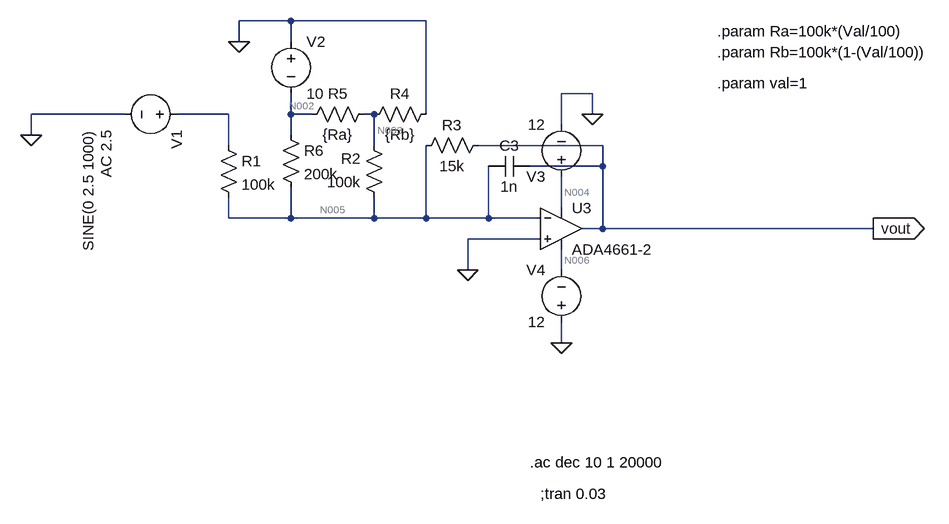
[diagram p0: schematic CV circuits.asc]
CV circuits.asc, the LTspice schematic file:
Version 4
SHEET 1 1768 680
WIRE 400 -144 320 -144
WIRE 608 -144 400 -144
WIRE 320 -112 320 -144
WIRE 400 -112 400 -144
WIRE 864 -32 816 -32
WIRE 144 0 0 0
WIRE 304 0 224 0
WIRE 400 0 400 -32
WIRE 432 0 400 0
WIRE 528 0 512 0
WIRE 608 0 608 -144
WIRE 864 0 864 -32
WIRE 816 16 816 -32
WIRE 0 32 0 0
WIRE 400 32 400 0
WIRE 304 48 304 0
WIRE 528 48 528 0
WIRE 880 48 688 48
WIRE 880 80 880 48
WIRE 880 80 768 80
WIRE 816 144 816 96
WIRE 304 160 304 128
WIRE 400 160 400 112
WIRE 400 160 304 160
WIRE 528 160 528 128
WIRE 528 160 400 160
WIRE 608 160 608 48
WIRE 608 160 528 160
WIRE 704 160 704 80
WIRE 704 160 608 160
WIRE 784 160 704 160
WIRE 880 176 880 80
WIRE 880 176 848 176
WIRE 1296 176 880 176
WIRE 784 192 672 192
WIRE 672 240 672 192
WIRE 816 240 816 208
WIRE 816 352 816 320
FLAG 1296 176 vout
IOPIN 1296 176 Out
FLAG 816 352 0
FLAG 864 0 0
FLAG 0 32 0
FLAG 672 240 0
FLAG 320 -112 0
SYMBOL voltage 240 0 R90
WINDOW 3 24 152 Left 2
WINDOW 123 24 124 Left 2
WINDOW 39 0 0 Left 0
SYMATTR Value SINE(0 2.5 1000)
SYMATTR Value2 AC 2.5
SYMATTR InstName V1
SYMBOL res 544 144 R180
WINDOW 0 36 76 Left 2
WINDOW 3 36 40 Left 2
SYMATTR InstName R2
SYMATTR Value 100k
SYMBOL res 704 32 R90
WINDOW 0 0 56 VBottom 2
WINDOW 3 32 56 VTop 2
SYMATTR InstName R3
SYMATTR Value 15k
SYMBOL voltage 816 112 R180
WINDOW 123 0 0 Left 0
WINDOW 39 0 0 Left 0
SYMATTR InstName V3
SYMATTR Value 12
SYMBOL voltage 816 336 R180
WINDOW 0 24 96 Left 2
WINDOW 3 24 16 Left 2
WINDOW 123 0 0 Left 0
WINDOW 39 0 0 Left 0
SYMATTR InstName V4
SYMATTR Value 12
SYMBOL Opamps\\ADA4661-2 816 112 R0
SYMATTR InstName U3
SYMBOL cap 768 64 R90
WINDOW 0 0 32 VBottom 2
WINDOW 3 32 32 VTop 2
SYMATTR InstName C3
SYMATTR Value 1n
SYMBOL res 288 32 R0
SYMATTR InstName R1
SYMATTR Value 100k
SYMBOL voltage 400 -128 R0
WINDOW 123 0 0 Left 0
WINDOW 39 0 0 Left 0
SYMATTR InstName V2
SYMATTR Value 10
SYMBOL res 528 -16 R90
WINDOW 0 0 56 VBottom 2
WINDOW 3 32 56 VTop 2
SYMATTR InstName R5
SYMATTR Value {Ra}
SYMBOL res 384 16 R0
SYMATTR InstName R6
SYMATTR Value 200k
SYMBOL res 624 -16 R90
WINDOW 0 0 56 VBottom 2
WINDOW 3 32 56 VTop 2
SYMATTR InstName R4
SYMATTR Value {Rb}
TEXT 768 536 Left 2 !.ac dec 10 1 20000
TEXT 784 584 Left 2 !;tran 0.03
TEXT 1056 -128 Left 2 !.param Ra=100k*(Val/100)
TEXT 1056 -96 Left 2 !.param Rb=100k*(1-(Val/100))
TEXT 1056 -48 Left 2 !.param val=1

The netlist it stands for:
* CV circuits.asc
V1 N001 0 SINE(0 2.5 1000) AC 2.5
R2 N005 N003 100k
R3 vout N005 15k
V3 N004 0 12
V4 0 N006 12
XU3 0 N005 N004 N006 vout ADA4661-2  ; pins In+ In- V+ V- OUT
C3 vout N005 1n
R1 N001 N005 100k
V2 0 N002 10
R5 N003 N002 {Ra}
R6 N002 N005 200k
R4 0 N003 {Rb}
.ac dec 10 1 20000
;tran 0.03
.param Ra=100k*(Val/100)
.param Rb=100k*(1-(Val/100))
.param val=1
.lib ADI1.lib
.backanno
.end

* Results of the author's LTspice run, read from the files saved beside the schematic
* Operating Point, zero values left out:
*   V(n005) = 510.5 µV
*   V(n003) = -9.803 V
*   V(vout) = 2.221 V
*   V(n004) = 12 V
*   V(n006) = -12 V
*   V(n002) = -10 V
*   I(R4) = 99.02 µA
*   I(R6) = -50 µA
*   I(R5) = 197.1 µA
*   I(R1) = -5.105 nA
*   I(R3) = 148 µA
*   I(R2) = 98.03 µA
*   I(V2) = -247.1 µA
*   I(V4) = -558.9 µA
*   I(V3) = -707 µA
*   I(V1) = 5.105 nA
*   Ix(u3:1) = 1.5 pA
*   Ix(u3:2) = -1.5 pA
*   Ix(u3:99) = 707 µA
*   Ix(u3:50) = -558.9 µA
*   Ix(u3:45) = -148 µA
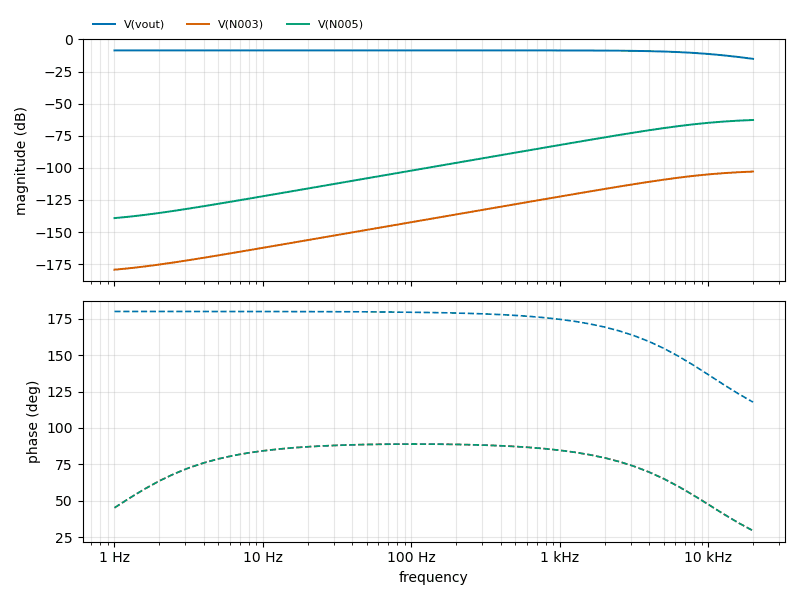
[diagram p1: AC Analysis of CV circuits.asc, plotted from the saved traces]
* AC Analysis, 1 run:
*   V(vout): -8.52 dB at 1 Hz, -15.11 dB at 20 kHz, peak -8.52 dB at 1 Hz, 3 dB below the peak at 10.55 kHz
*   V(N003): -179.33 dB at 1 Hz, -102.89 dB at 20 kHz, peak -102.89 dB at 20 kHz, 3 dB below the peak at 8.525 kHz
*   V(N005): -139.16 dB at 1 Hz, -62.71 dB at 20 kHz, peak -62.71 dB at 20 kHz, 3 dB below the peak at 8.525 kHz